# EasyEDA schematic SCH_Joker_2025-09-11.json
TITLE: JOKER; REV: 1.0; Date: 2021-11-29; Sheet: 1/1; Drawn By: k0bi; Company: GAMEPE
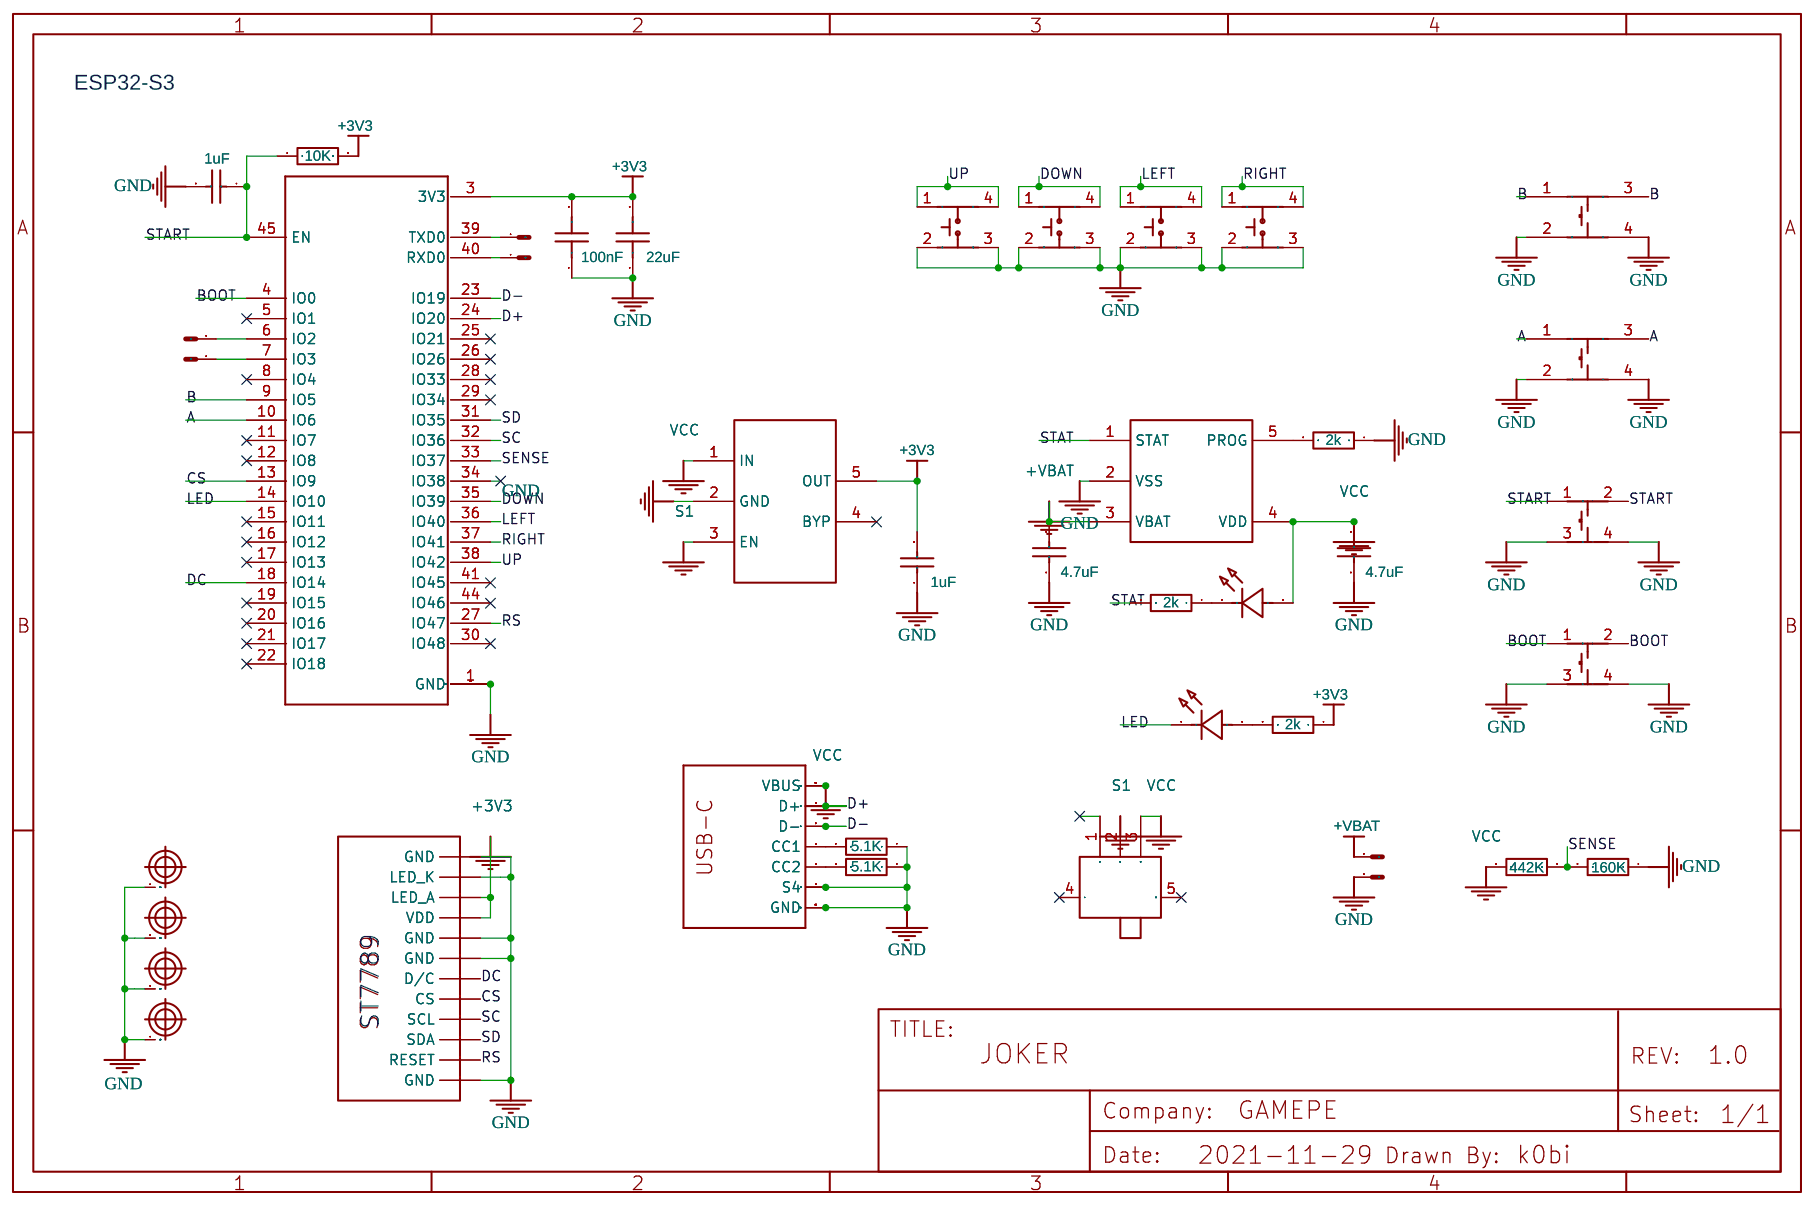
[diagram p0: schematic sheet]

## Parts
C2  1uF  [C0603B]
C3  100nF  [C0603B]
C4  22uF  [C0603B]
C5  1uF  [C0603B]
C6  4.7uF  [C0603B]
C7  4.7uF  [C0603B]
H1  M2-MOUNT-HOLE  [M2-MOUNT-HOLE]
H2  M2-MOUNT-HOLE  [M2-MOUNT-HOLE]
H3  M2-MOUNT-HOLE  [M2-MOUNT-HOLE]
H4  M2-MOUNT-HOLE  [M2-MOUNT-HOLE]
LED1  le  [LED0603-RD]
LED2  le  [LED0603-RD]
R1  2k  [R0603-S]
R2  2k  [R0603-S]
R6  10K  [R0603-S]
R10  5.1K  [R0603-S]
R11  5.1K  [R0603-S]
R13  2k  [R0603-S]
R15  442K  [R0603-S]
R16  160K  [R0603-S]
SW1  SKRRAAE010  [BTN5.5]
SW2  SKRRAAE010  [BTN5.5]
SW3  TS-2630-B  [SW-SMD_4P-L3.0-W2.6-P1.80-LS3.5]
SW4  TS-2630-B  [SW-SMD_4P-L3.0-W2.6-P1.80-LS3.5]
SW6  C219784  [C219784]
SW7  C219784  [C219784]
SW8  C219784  [C219784]
SW9  C219784  [C219784]
SW10  MINI MSK12CO2  [SW-SMD_MSK12CO2]
TP4  TP/SP-1.5X1.0  [SOLDERPAD_1.5X1.0]
TP6  TP/SP-1.5X1.0  [SOLDERPAD_1.5X1.0]
TP13  TP/SP-1.5X1.0  [SOLDERPAD_1.5X1.0]
TP14  TP/SP-1.5X1.0  [SOLDERPAD_1.5X1.0]
TP15  TP/SP-1.5X1.0  [SOLDERPAD_1.5X1.0]
TP16  TP/SP-1.5X1.0  [SOLDERPAD_1.5X1.0]
U1  ESP32-S3-MINI-1-N8  [ESP32-S3-MINI-1-N8]
U2  SPX3819M5-L-3-3/TR  [SOT-23-5_L3.0-W1.7-P0.95-LS2.8-BR]
U3  MCP73831T-2ATI/OT  [SOT-23-5_L3.0-W1.7-P0.95-LS2.8-BR]
U4  1.3" RGB TFT LCD  [1.3" 240X240 RGB TFT LCD]
U6  C136423  [C136423]

## Library data of the parts
C2 = CL10A105KA8NNNC: Supplier: LCSC; Manufacturer: SAMSUNG(三星); Supplier Part: C5673; JLCPCB Part Class: Extended Part
C3 = CL10B104KA8NNNC: Supplier: LCSC; Manufacturer: SAMSUNG(三星); Supplier Part: C1590; JLCPCB Part Class: Extended Part
C4 = CL10A226MP8NUNE: Supplier: LCSC; Manufacturer: SAMSUNG(三星); Supplier Part: C86295; JLCPCB Part Class: Extended Part
C5 = CC0603MRX5R6BB106: Supplier: LCSC; Manufacturer: YAGEO; Supplier Part: C109453; JLCPCB Part Class: Extended Part
C6 C7 = CL10A105KA8NNNC: Supplier: LCSC; Manufacturer: SAMSUNG; Supplier Part: C5673; JLCPCB Part Class: Extended Part
H1-H4 = M2-MOUNT-HOLE: Contributor: adamalfath
LED1 LED2 = TZ-P2-0603YGTCS1-0.6T: Supplier: LCSC; Supplier Part: C916074; Manufacturer: TUOZHAN; Contributor: k0bi; JLCPCB Part Class: Extended Part
R1 R2 R10 R11 R13 R15 R16 = RC0603FR-0710KL: Supplier: LCSC; Manufacturer: YAGEO; Supplier Part: C98220; JLCPCB Part Class: Extended Part; Resistance: 10kΩ
R6 = RC0603FR-0710KL: Supplier: LCSC; Manufacturer: YAGEO(国巨); Supplier Part: C98220; JLCPCB Part Class: Extended Part; Resistance: 10kΩ
SW1 SW2 = SKRRAAE010: Supplier: LCSC; Manufacturer: ALPSALPINE(阿尔卑斯阿尔派); Contributor: LCSC; Supplier Part: C961669; JLCPCB Part Class: Extended Part
SW3 SW4 = TS-2630-B: Supplier: LCSC; Supplier Part: C1121888; Manufacturer: XKB Connectivity(中国星坤); Contributor: LCSC; JLCPCB Part Class: Extended Part
SW6-SW9 = C219784: Contributor: k0bi; Supplier: LCSC; Manufacturer: ALPSALPINE(阿尔卑斯阿尔派); Manufacturer Part: SKTKABE010; JLCPCB Part Class: Extended Part
SW10 = MINI MSK12CO2: Contributor: LCSC; Supplier: LCSC; Supplier Part: C2681570; Manufacturer: SHOU HAN(首韩); JLCPCB Part Class: Extended Part
TP4 TP6 TP13-TP16 = TP/SP-1.5X1.0: Contributor: k0bi
U1 = ESP32-S3-MINI-1-N8: Contributor: k0bi
U2 = SPX3819M5-L-3-3/TR: Supplier: LCSC; Manufacturer: EXAR; Supplier Part: C9055; JLCPCB Part Class: Extended Part
U3 = MCP73831T-2ATI/OT: Supplier: LCSC; Manufacturer: MICROCHIP; Supplier Part: C14879; JLCPCB Part Class: Extended Part
U4 = 1.3" RGB TFT LCD: Manufacturer: Shenzhen Allvision Tech; Manufacturer Part: N133-2424TCBIG01-H12; Supplier: LCSC; Supplier Part: C2890617; Contributor: k0bi
U6 = C136423: Contributor: k0bi

## Nets
+3V3: C3.2 C4.2 C5.2 R2.1 R6.2 U1.3(3V3) U2.5(OUT) U4.3(LED_A) U4.4(VDD)
+VBAT: C6.1 TP16.1(S) U3.3(VBAT)
GND: C2.2 C3.1 C4.1 C5.1 C6.2 C7.2 H1.1(GND) H2.1(GND) H3.1(GND) H4.1(GND) R10.1 R11.1 R13.1 R16.1 SW1.2 SW1.4 SW2.2 SW2.4 SW3.3 SW3.4 SW4.3 SW4.4 SW6.2 SW6.3 SW7.2 SW7.3 SW8.2 SW8.3 SW9.2 SW9.3 TP15.1(S) U1.1(GND) U1.2(GND) U1.42(GND) U1.43(GND) U1.46(GND) U1.47(GND) U1.48(GND) U1.49(GND) U1.50(GND) U1.51(GND) U1.52(GND) U1.53(GND) U1.54(GND) U1.55(GND) U1.56(GND) U1.57(GND) U1.58(GND) U1.59(GND) U1.60(GND) U1.61(GND) U1.61_1(GND) U1.61_2(GND) U1.61_3(GND) U1.61_4(GND) U1.61_5(GND) U1.61_6(GND) U1.61_7(GND) U1.61_8(GND) U1.62(GND) U1.63(GND) U1.64(GND) U1.65(GND) U2.2(GND) U3.2(VSS) U4.1(GND) U4.2(LED_K) U4.5(GND) U4.6(GND) U4.12(GND) U6.1(S4) U6.2(S4) U6.3(S4) U6.4(S4) U6.A1-B12(GND) U6.B1-A12(GND)
VCC: C7.1 LED1.2(A) R15.2 SW10.3 U2.1(IN) U3.4(VDD) U6.A4-B9(VBUS) U6.B4-A9(VBUS)
A: SW1.1 SW1.3 U1.10(IO6)
B: SW2.1 SW2.3 U1.9(IO5)
BOOT: SW4.1 SW4.2 U1.4(IO0)
CS: U1.13(IO9) U4.8(CS)
D+: U1.24(IO20) U6.A6(D+) U6.B6(D+)
D-: U1.23(IO19) U6.A7(D-) U6.B7(D-)
DC: U1.18(IO14) U4.7(D/C)
DOWN: SW8.1 SW8.4 U1.35(IO39)
LED: LED2.1(K) U1.14(IO10)
LEFT: SW7.1 SW7.4 U1.36(IO40)
RIGHT: SW6.1 SW6.4 U1.37(IO41)
RS: U1.27(IO47) U4.11(RESET)
S1: SW10.2 U2.3(EN)
SC: U1.32(IO36) U4.9(SCL)
SD: U1.31(IO35) U4.10(SDA)
SENSE: R15.1 R16.2 U1.33(IO37)
START: C2.1 R6.1 SW3.1 SW3.2 U1.45(EN)
STAT: R1.2 U3.1(STAT)
UP: SW9.1 SW9.4 U1.38(IO42)
Net-(LED1-1): LED1.1(K) R1.1
Net-(LED2-2): LED2.2(A) R2.2
Net-(R10-2): R10.2 U6.A5(CC1)
Net-(R11-2): R11.2 U6.B5(CC2)
Net-(R13-2): R13.2 U3.5(PROG)
Net-(TP4-1): TP4.1(S) U1.39(TXD0)
Net-(TP6-1): TP6.1(S) U1.40(RXD0)
Net-(TP13-1): TP13.1(S) U1.7(IO3)
Net-(TP14-1): TP14.1(S) U1.6(IO2)

Not connected (* = marked no-connect by the designer): SW10 1 4* 5*; U1 5(IO1)* 8(IO4)* 11(IO7)* 12(IO8)* 15(IO11)* 16(IO12)* 17(IO13)* 19(IO15)* 20(IO16)* 21(IO17)* 22(IO18)* 25(IO21)* 26(IO26)* 28(IO33)* 29(IO34)* 30(IO48)* 34(IO38) 41(IO45)* 44(IO46)*; U2 4(BYP)*

## Notes on the sheet
- ESP32-S3
- ST7789
